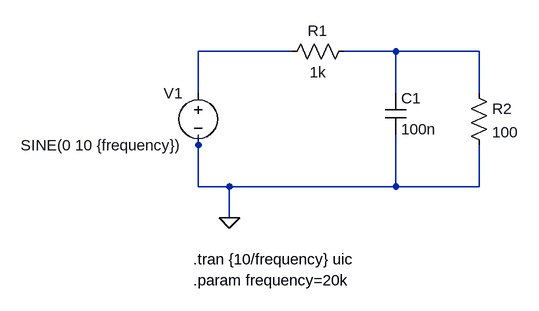
[diagram p0: schematic Draft1.asc]
Draft1.asc, the LTspice schematic file:
Version 4
SHEET 1 880 680
WIRE 240 64 96 64
WIRE 400 64 320 64
WIRE 528 64 400 64
WIRE 96 128 96 64
WIRE 400 128 400 64
WIRE 528 128 528 64
WIRE 96 208 96 192
WIRE 96 272 96 208
WIRE 144 272 96 272
WIRE 400 272 400 192
WIRE 400 272 144 272
WIRE 528 272 528 208
WIRE 528 272 400 272
WIRE 144 320 144 272
FLAG 144 320 0
SYMBOL voltage 96 112 M0
WINDOW 123 0 0 Left 0
WINDOW 39 0 0 Left 0
SYMATTR InstName V1
SYMATTR Value SINE(0 10 {frequency})
SYMBOL res 336 48 R90
WINDOW 0 0 56 VBottom 2
WINDOW 3 32 56 VTop 2
SYMATTR InstName R1
SYMATTR Value 1k
SYMBOL cap 384 128 R0
SYMATTR InstName C1
SYMATTR Value 100n
SYMBOL res 512 112 R0
SYMATTR InstName R2
SYMATTR Value 100
TEXT 88 384 Left 2 !.tran {10/frequency} uic
TEXT 88 416 Left 2 !.param frequency=20k

The netlist it stands for:
* Draft1.asc
V1 N001 0 SINE(0 10 {frequency})
R1 N002 N001 1k
C1 N002 0 100n
R2 N002 0 100
.tran {10/frequency} uic
.param frequency=20k
.backanno
.end